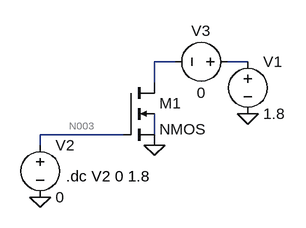
[diagram p0: schematic tut2 Q10 NMOS Vgs.asc]
tut2 Q10 NMOS Vgs.asc, the LTspice schematic file:
Version 4
SHEET 1 880 680
WIRE 144 64 112 64
WIRE 256 64 224 64
WIRE 112 96 112 64
WIRE 64 176 -64 176
WIRE 112 176 112 144
WIRE -64 192 -64 176
FLAG 112 192 0
FLAG 256 144 0
FLAG -64 272 0
SYMBOL nmos4 64 96 R0
SYMATTR InstName M1
SYMATTR Value2 l=.18 w=5
SYMBOL voltage 256 48 R0
WINDOW 123 0 0 Left 2
WINDOW 39 0 0 Left 2
SYMATTR InstName V1
SYMATTR Value 1.8
SYMBOL voltage -64 176 R0
WINDOW 123 0 0 Left 2
WINDOW 39 0 0 Left 2
SYMATTR InstName V2
SYMATTR Value 0
SYMBOL voltage 240 64 R90
WINDOW 0 -32 56 VBottom 2
WINDOW 3 32 56 VTop 2
WINDOW 123 0 0 Left 2
WINDOW 39 0 0 Left 2
SYMATTR InstName V3
SYMATTR Value 0
TEXT -24 240 Left 2 !.dc V2 0 1.8

The netlist it stands for:
* tut2 Q10 NMOS Vgs.asc
M1 N001 N003 0 N004 NMOS l=.18 w=5
V1 N002 0 1.8
V2 N003 0 0
V3 N002 N001 0
.model NMOS NMOS
.model PMOS PMOS
.lib standard.mos
.dc V2 0 1.8
.backanno
.end

* Results of the author's LTspice run, read from the files saved beside the schematic
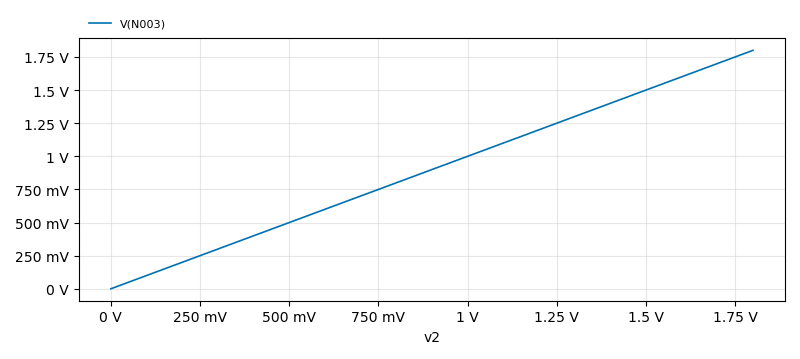
[diagram p1: DC transfer characteristic of tut2 Q10 NMOS Vgs.asc, plotted from the saved traces]
* DC transfer characteristic, 1 run:
*   V(N003): 0 V at v2=0 V, 1.8 V at v2=1.8 V, min 0 V, max 1.8 V